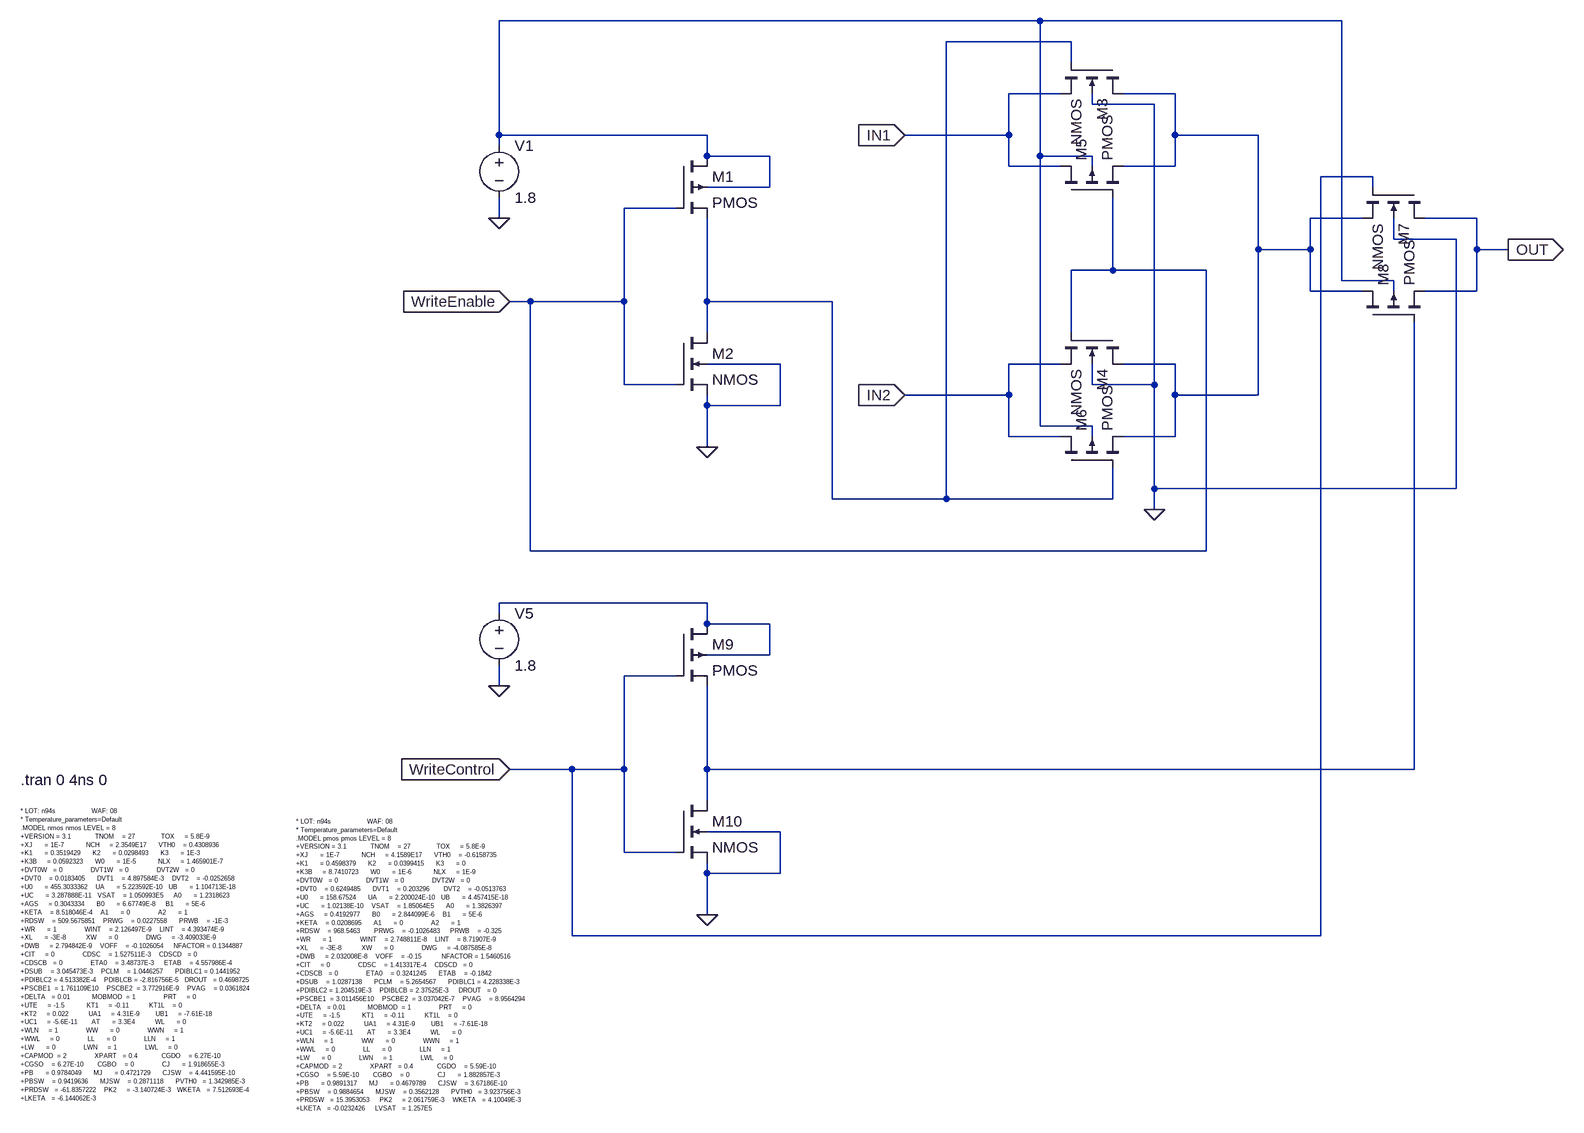
[diagram p0: schematic 2x1_MUX.asc]
2x1_MUX.asc, the LTspice schematic file:
Version 4
SHEET 1 2420 1432
WIRE 688 -112 -144 -112
WIRE 1152 -112 688 -112
WIRE 736 -80 544 -80
WIRE 736 -48 736 -80
WIRE 720 0 640 0
WIRE 896 0 816 0
WIRE 768 16 768 0
WIRE 864 16 768 16
WIRE -144 64 -144 -112
WIRE 176 64 -144 64
WIRE 640 64 640 0
WIRE 640 64 480 64
WIRE 896 64 896 0
WIRE 1024 64 896 64
WIRE -144 80 -144 64
WIRE 176 96 176 64
WIRE 272 96 176 96
WIRE 688 96 688 -112
WIRE 768 96 688 96
WIRE 640 112 640 64
WIRE 720 112 640 112
WIRE 768 112 768 96
WIRE 896 112 896 64
WIRE 896 112 816 112
WIRE 1200 128 1120 128
WIRE 272 144 272 96
WIRE 272 144 176 144
WIRE 1200 144 1200 128
WIRE 128 176 48 176
WIRE -144 192 -144 160
WIRE 1184 192 1104 192
WIRE 1360 192 1280 192
WIRE 1232 224 1232 192
WIRE 1328 224 1232 224
WIRE 1024 240 1024 64
WIRE 1104 240 1104 192
WIRE 1104 240 1024 240
WIRE 1360 240 1360 192
WIRE 1408 240 1360 240
WIRE 800 272 800 160
WIRE 800 272 736 272
WIRE 944 272 800 272
WIRE 1152 288 1152 -112
WIRE 1232 288 1152 288
WIRE 1104 304 1104 240
WIRE 1184 304 1104 304
WIRE 1232 304 1232 288
WIRE 1360 304 1360 240
WIRE 1360 304 1280 304
WIRE -96 320 -128 320
WIRE 48 320 48 176
WIRE 48 320 -96 320
WIRE 176 320 176 192
WIRE 368 320 176 320
WIRE 176 368 176 320
WIRE 736 368 736 272
WIRE 288 416 176 416
WIRE 720 416 640 416
WIRE 896 416 816 416
WIRE 48 448 48 320
WIRE 128 448 48 448
WIRE 768 448 768 416
WIRE 864 448 864 16
WIRE 864 448 768 448
WIRE 640 464 640 416
WIRE 640 464 480 464
WIRE 896 464 896 416
WIRE 1024 464 1024 240
WIRE 1024 464 896 464
WIRE 176 480 176 464
WIRE 288 480 288 416
WIRE 288 480 176 480
WIRE 688 512 688 96
WIRE 768 512 688 512
WIRE 640 528 640 464
WIRE 720 528 640 528
WIRE 768 528 768 512
WIRE 896 528 896 464
WIRE 896 528 816 528
WIRE 176 544 176 480
WIRE 864 608 864 448
WIRE 1328 608 1328 224
WIRE 1328 608 864 608
WIRE 368 624 368 320
WIRE 544 624 544 -80
WIRE 544 624 368 624
WIRE 800 624 800 576
WIRE 800 624 544 624
WIRE 864 640 864 608
WIRE -96 704 -96 320
WIRE 944 704 944 272
WIRE 944 704 -96 704
WIRE 176 784 -144 784
WIRE -144 800 -144 784
WIRE 176 816 176 784
WIRE 272 816 176 816
WIRE 272 864 272 816
WIRE 272 864 176 864
WIRE 128 896 48 896
WIRE -144 912 -144 880
WIRE -32 1040 -128 1040
WIRE 48 1040 48 896
WIRE 48 1040 -32 1040
WIRE 176 1040 176 912
WIRE 1264 1040 1264 352
WIRE 1264 1040 176 1040
WIRE 176 1088 176 1040
WIRE 288 1136 176 1136
WIRE 48 1168 48 1040
WIRE 128 1168 48 1168
WIRE 176 1200 176 1184
WIRE 288 1200 288 1136
WIRE 288 1200 176 1200
WIRE 176 1264 176 1200
WIRE -32 1296 -32 1040
WIRE 1120 1296 1120 128
WIRE 1120 1296 -32 1296
FLAG 176 544 0
FLAG -144 192 0
FLAG -128 320 WriteEnable
IOPIN -128 320 In
FLAG 1408 240 OUT
IOPIN 1408 240 Out
FLAG 480 64 IN1
IOPIN 480 64 In
FLAG 480 464 IN2
IOPIN 480 464 In
FLAG 864 640 0
FLAG 176 1264 0
FLAG -144 912 0
FLAG -128 1040 WriteControl
IOPIN -128 1040 In
SYMBOL pmos4 128 96 R0
SYMATTR InstName M1
SYMATTR Value2 l=180n w=880n
SYMBOL nmos4 128 368 R0
SYMATTR InstName M2
SYMATTR Value2 l=180n w=440n
SYMBOL Voltage -144 64 R0
SYMATTR InstName V1
SYMATTR Value 1.8
SYMBOL nmos4 816 -48 R90
SYMATTR InstName M3
SYMATTR Value2 l=180n w=440n
SYMBOL nmos4 816 368 R90
SYMATTR InstName M4
SYMATTR Value2 l=180n w=440n
SYMBOL pmos4 720 160 R270
SYMATTR InstName M5
SYMATTR Value2 l=180n w=440n
SYMBOL pmos4 720 576 R270
SYMATTR InstName M6
SYMATTR Value2 l=180n w=440n
SYMBOL nmos4 1280 144 R90
SYMATTR InstName M7
SYMATTR Value2 l=180n w=440n
SYMBOL pmos4 1184 352 R270
SYMATTR InstName M8
SYMATTR Value2 l=180n w=440n
SYMBOL pmos4 128 816 R0
SYMATTR InstName M9
SYMATTR Value2 l=180n w=880n
SYMBOL nmos4 128 1088 R0
SYMATTR InstName M10
SYMATTR Value2 l=180n w=440n
SYMBOL Voltage -144 784 R0
SYMATTR InstName V5
SYMATTR Value 1.8
TEXT -880 1104 Left 0 !* LOT: n94s                  WAF: 08\n* Temperature_parameters=Default\n.MODEL nmos nmos LEVEL = 8\n+VERSION = 3.1            TNOM    = 27             TOX     = 5.8E-9\n+XJ      = 1E-7           NCH     = 2.3549E17      VTH0    = 0.4308936\n+K1      = 0.3519429      K2      = 0.0298493      K3      = 1E-3\n+K3B     = 0.0592323      W0      = 1E-5           NLX     = 1.465901E-7\n+DVT0W   = 0              DVT1W   = 0              DVT2W   = 0\n+DVT0    = 0.0183405      DVT1    = 4.897584E-3    DVT2    = -0.0252658\n+U0      = 455.3033362    UA      = 5.223592E-10   UB      = 1.104713E-18\n+UC      = 3.287888E-11   VSAT    = 1.050993E5     A0      = 1.2318623\n+AGS     = 0.3043334      B0      = 6.67749E-8     B1      = 5E-6\n+KETA    = 8.518046E-4    A1      = 0              A2      = 1\n+RDSW    = 509.5675851    PRWG    = 0.0227558      PRWB    = -1E-3\n+WR      = 1              WINT    = 2.126497E-9    LINT    = 4.393474E-9\n+XL      = -3E-8          XW      = 0              DWG     = -3.409033E-9\n+DWB     = 2.794842E-9    VOFF    = -0.1026054     NFACTOR = 0.1344887\n+CIT     = 0              CDSC    = 1.527511E-3    CDSCD   = 0\n+CDSCB   = 0              ETA0    = 3.48737E-3     ETAB    = 4.557986E-4\n+DSUB    = 3.045473E-3    PCLM    = 1.0446257      PDIBLC1 = 0.1441952\n+PDIBLC2 = 4.513382E-4    PDIBLCB = -2.816756E-5   DROUT   = 0.4698725\n+PSCBE1  = 1.761109E10    PSCBE2  = 3.772916E-9    PVAG    = 0.0361824\n+DELTA   = 0.01           MOBMOD  = 1              PRT     = 0\n+UTE     = -1.5           KT1     = -0.11          KT1L    = 0\n+KT2     = 0.022          UA1     = 4.31E-9        UB1     = -7.61E-18\n+UC1     = -5.6E-11       AT      = 3.3E4          WL      = 0\n+WLN     = 1              WW      = 0              WWN     = 1\n+WWL     = 0              LL      = 0              LLN     = 1\n+LW      = 0              LWN     = 1              LWL     = 0\n+CAPMOD  = 2              XPART   = 0.4            CGDO    = 6.27E-10\n+CGSO    = 6.27E-10       CGBO    = 0              CJ      = 1.918655E-3\n+PB      = 0.9784049      MJ      = 0.4721729      CJSW    = 4.441595E-10\n+PBSW    = 0.9419636      MJSW    = 0.2871118      PVTH0   = 1.342985E-3\n+PRDSW   = -61.8357222    PK2     = -3.140724E-3   WKETA   = 7.512693E-4\n+LKETA   = -6.144062E-3
TEXT -456 1120 Left 0 !* LOT: n94s                  WAF: 08\n* Temperature_parameters=Default\n.MODEL pmos pmos LEVEL = 8\n+VERSION = 3.1            TNOM    = 27             TOX     = 5.8E-9\n+XJ      = 1E-7           NCH     = 4.1589E17      VTH0    = -0.6158735\n+K1      = 0.4598379      K2      = 0.0399415      K3      = 0\n+K3B     = 8.7410723      W0      = 1E-6           NLX     = 1E-9\n+DVT0W   = 0              DVT1W   = 0              DVT2W   = 0\n+DVT0    = 0.6249485      DVT1    = 0.203296       DVT2    = -0.0513763\n+U0      = 158.67524      UA      = 2.200024E-10   UB      = 4.457415E-18\n+UC      = 1.02138E-10    VSAT    = 1.85064E5      A0      = 1.3826397\n+AGS     = 0.4192977      B0      = 2.844099E-6    B1      = 5E-6\n+KETA    = 0.0208695      A1      = 0              A2      = 1\n+RDSW    = 968.5463       PRWG    = -0.1026483     PRWB    = -0.325\n+WR      = 1              WINT    = 2.748811E-8    LINT    = 8.71907E-9\n+XL      = -3E-8          XW      = 0              DWG     = -4.087585E-8\n+DWB     = 2.032008E-8    VOFF    = -0.15          NFACTOR = 1.5460516\n+CIT     = 0              CDSC    = 1.413317E-4    CDSCD   = 0\n+CDSCB   = 0              ETA0    = 0.3241245      ETAB    = -0.1842\n+DSUB    = 1.0287138      PCLM    = 5.2654567      PDIBLC1 = 4.228338E-3\n+PDIBLC2 = 1.204519E-3    PDIBLCB = 2.37525E-3     DROUT   = 0\n+PSCBE1  = 3.011456E10    PSCBE2  = 3.037042E-7    PVAG    = 8.9564294\n+DELTA   = 0.01           MOBMOD  = 1              PRT     = 0\n+UTE     = -1.5           KT1     = -0.11          KT1L    = 0\n+KT2     = 0.022          UA1     = 4.31E-9        UB1     = -7.61E-18\n+UC1     = -5.6E-11       AT      = 3.3E4          WL      = 0\n+WLN     = 1              WW      = 0              WWN     = 1\n+WWL     = 0              LL      = 0              LLN     = 1\n+LW      = 0              LWN     = 1              LWL     = 0\n+CAPMOD  = 2              XPART   = 0.4            CGDO    = 5.59E-10\n+CGSO    = 5.59E-10       CGBO    = 0              CJ      = 1.882857E-3\n+PB      = 0.9891317      MJ      = 0.4679789      CJSW    = 3.67186E-10\n+PBSW    = 0.9884654      MJSW    = 0.3562128      PVTH0   = 3.923756E-3\n+PRDSW   = 15.3953053     PK2     = 2.061759E-3    WKETA   = 4.10049E-3\n+LKETA   = -0.0232426     LVSAT   = 1.257E5
TEXT -880 1056 Left 2 !.tran 0 4ns 0

The netlist it stands for:
* 2x1_MUX.asc
M1 N001 WriteEnable N002 N001 PMOS l=180n w=880n
M2 N002 WriteEnable 0 0 NMOS l=180n w=440n
V1 N001 0 1.8
M3 N003 N002 IN1 0 NMOS l=180n w=440n
M4 N003 WriteEnable IN2 0 NMOS l=180n w=440n
M5 IN1 WriteEnable N003 N001 PMOS l=180n w=440n
M6 IN2 N002 N003 N001 PMOS l=180n w=440n
M7 OUT WriteControl N003 0 NMOS l=180n w=440n
M8 N003 N005 OUT N001 PMOS l=180n w=440n
M9 N004 WriteControl N005 N004 PMOS l=180n w=880n
M10 N005 WriteControl 0 0 NMOS l=180n w=440n
V5 N004 0 1.8
.model NMOS NMOS
.model PMOS PMOS
.lib standard.mos
* LOT: n94s                  WAF: 08
* Temperature_parameters=Default
.MODEL nmos nmos LEVEL = 8
+VERSION = 3.1            TNOM    = 27             TOX     = 5.8E-9
+XJ      = 1E-7           NCH     = 2.3549E17      VTH0    = 0.4308936
+K1      = 0.3519429      K2      = 0.0298493      K3      = 1E-3
+K3B     = 0.0592323      W0      = 1E-5           NLX     = 1.465901E-7
+DVT0W   = 0              DVT1W   = 0              DVT2W   = 0
+DVT0    = 0.0183405      DVT1    = 4.897584E-3    DVT2    = -0.0252658
+U0      = 455.3033362    UA      = 5.223592E-10   UB      = 1.104713E-18
+UC      = 3.287888E-11   VSAT    = 1.050993E5     A0      = 1.2318623
+AGS     = 0.3043334      B0      = 6.67749E-8     B1      = 5E-6
+KETA    = 8.518046E-4    A1      = 0              A2      = 1
+RDSW    = 509.5675851    PRWG    = 0.0227558      PRWB    = -1E-3
+WR      = 1              WINT    = 2.126497E-9    LINT    = 4.393474E-9
+XL      = -3E-8          XW      = 0              DWG     = -3.409033E-9
+DWB     = 2.794842E-9    VOFF    = -0.1026054     NFACTOR = 0.1344887
+CIT     = 0              CDSC    = 1.527511E-3    CDSCD   = 0
+CDSCB   = 0              ETA0    = 3.48737E-3     ETAB    = 4.557986E-4
+DSUB    = 3.045473E-3    PCLM    = 1.0446257      PDIBLC1 = 0.1441952
+PDIBLC2 = 4.513382E-4    PDIBLCB = -2.816756E-5   DROUT   = 0.4698725
+PSCBE1  = 1.761109E10    PSCBE2  = 3.772916E-9    PVAG    = 0.0361824
+DELTA   = 0.01           MOBMOD  = 1              PRT     = 0
+UTE     = -1.5           KT1     = -0.11          KT1L    = 0
+KT2     = 0.022          UA1     = 4.31E-9        UB1     = -7.61E-18
+UC1     = -5.6E-11       AT      = 3.3E4          WL      = 0
+WLN     = 1              WW      = 0              WWN     = 1
+WWL     = 0              LL      = 0              LLN     = 1
+LW      = 0              LWN     = 1              LWL     = 0
+CAPMOD  = 2              XPART   = 0.4            CGDO    = 6.27E-10
+CGSO    = 6.27E-10       CGBO    = 0              CJ      = 1.918655E-3
+PB      = 0.9784049      MJ      = 0.4721729      CJSW    = 4.441595E-10
+PBSW    = 0.9419636      MJSW    = 0.2871118      PVTH0   = 1.342985E-3
+PRDSW   = -61.8357222    PK2     = -3.140724E-3   WKETA   = 7.512693E-4
+LKETA   = -6.144062E-3
* LOT: n94s                  WAF: 08
* Temperature_parameters=Default
.MODEL pmos pmos LEVEL = 8
+VERSION = 3.1            TNOM    = 27             TOX     = 5.8E-9
+XJ      = 1E-7           NCH     = 4.1589E17      VTH0    = -0.6158735
+K1      = 0.4598379      K2      = 0.0399415      K3      = 0
+K3B     = 8.7410723      W0      = 1E-6           NLX     = 1E-9
+DVT0W   = 0              DVT1W   = 0              DVT2W   = 0
+DVT0    = 0.6249485      DVT1    = 0.203296       DVT2    = -0.0513763
+U0      = 158.67524      UA      = 2.200024E-10   UB      = 4.457415E-18
+UC      = 1.02138E-10    VSAT    = 1.85064E5      A0      = 1.3826397
+AGS     = 0.4192977      B0      = 2.844099E-6    B1      = 5E-6
+KETA    = 0.0208695      A1      = 0              A2      = 1
+RDSW    = 968.5463       PRWG    = -0.1026483     PRWB    = -0.325
+WR      = 1              WINT    = 2.748811E-8    LINT    = 8.71907E-9
+XL      = -3E-8          XW      = 0              DWG     = -4.087585E-8
+DWB     = 2.032008E-8    VOFF    = -0.15          NFACTOR = 1.5460516
+CIT     = 0              CDSC    = 1.413317E-4    CDSCD   = 0
+CDSCB   = 0              ETA0    = 0.3241245      ETAB    = -0.1842
+DSUB    = 1.0287138      PCLM    = 5.2654567      PDIBLC1 = 4.228338E-3
+PDIBLC2 = 1.204519E-3    PDIBLCB = 2.37525E-3     DROUT   = 0
+PSCBE1  = 3.011456E10    PSCBE2  = 3.037042E-7    PVAG    = 8.9564294
+DELTA   = 0.01           MOBMOD  = 1              PRT     = 0
+UTE     = -1.5           KT1     = -0.11          KT1L    = 0
+KT2     = 0.022          UA1     = 4.31E-9        UB1     = -7.61E-18
+UC1     = -5.6E-11       AT      = 3.3E4          WL      = 0
+WLN     = 1              WW      = 0              WWN     = 1
+WWL     = 0              LL      = 0              LLN     = 1
+LW      = 0              LWN     = 1              LWL     = 0
+CAPMOD  = 2              XPART   = 0.4            CGDO    = 5.59E-10
+CGSO    = 5.59E-10       CGBO    = 0              CJ      = 1.882857E-3
+PB      = 0.9891317      MJ      = 0.4679789      CJSW    = 3.67186E-10
+PBSW    = 0.9884654      MJSW    = 0.3562128      PVTH0   = 3.923756E-3
+PRDSW   = 15.3953053     PK2     = 2.061759E-3    WKETA   = 4.10049E-3
+LKETA   = -0.0232426     LVSAT   = 1.257E5
.tran 0 4ns 0
.backanno
.end